# Altium schematic sheet UD3.1 Digital IO.SchDoc
size A4; DocumentNumber: 5; SheetNumber: 5; SheetTotal: 7
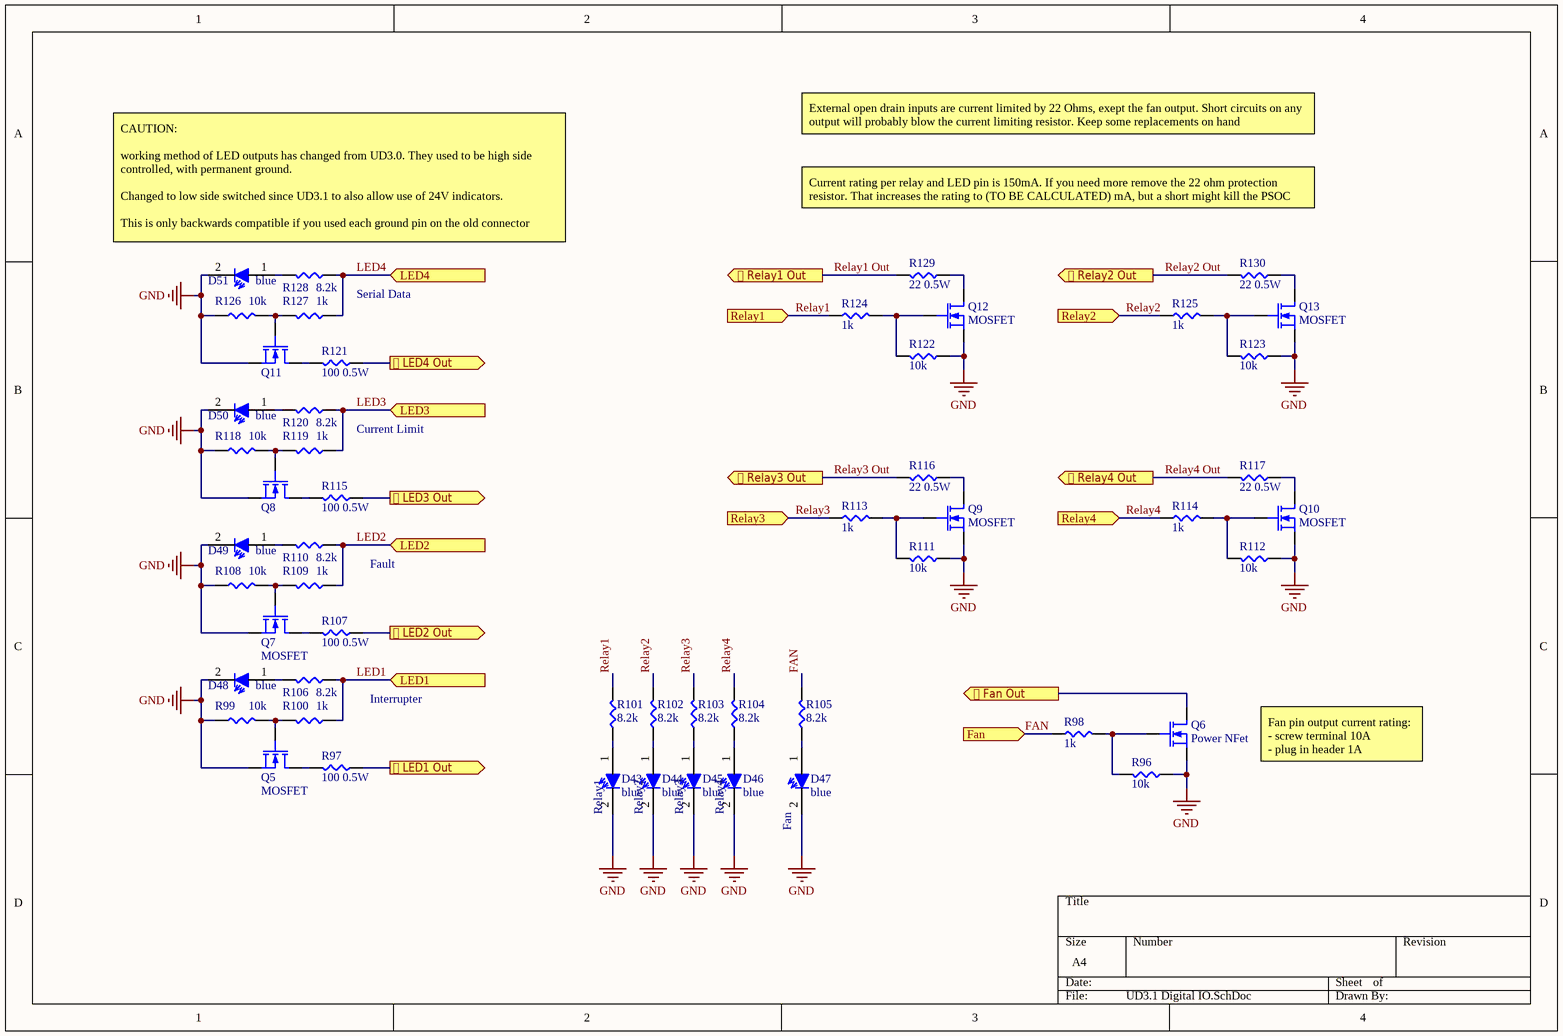
[diagram p0: UD3.1 Digital IO.SchDoc]

## Parts
D43  blue  [1206 Reverse Mount]
D44  blue  [1206 Reverse Mount]
D45  blue  [1206 Reverse Mount]
D46  blue  [1206 Reverse Mount]
D47  blue  [1206 Reverse Mount]
D48  blue  [1206 Reverse Mount]
D49  blue  [1206 Reverse Mount]
D50  blue  [1206 Reverse Mount]
D51  blue  [1206 Reverse Mount]
Q5  MOSFET  [sot 23]
Q6  Power NFet  [SOIC8]
Q7  MOSFET  [sot 23]
Q8  MOSFET  [sot 23]  (value not drawn)
Q9  MOSFET  [sot 23]
Q10  MOSFET  [sot 23]
Q11  MOSFET  [sot 23]  (value not drawn)
Q12  MOSFET  [sot 23]
Q13  MOSFET  [sot 23]
R96  10k  [0603]
R97  100 0.5W  [1206]
R98  1k  [0603]
R99  10k  [0603]
R100  1k  [0603]
R101  8.2k  [0603]
R102  8.2k  [0603]
R103  8.2k  [0603]
R104  8.2k  [0603]
R105  8.2k  [0603]
R106  8.2k  [0603]
R107  100 0.5W  [1206]
R108  10k  [0603]
R109  1k  [0603]
R110  8.2k  [0603]
R111  10k  [0603]
R112  10k  [0603]
R113  1k  [0603]
R114  1k  [0603]
R115  100 0.5W  [1206]
R116  22 0.5W  [1206]
R117  22 0.5W  [1206]
R118  10k  [0603]
R119  1k  [0603]
R120  8.2k  [0603]
R121  100 0.5W  [1206]
R122  10k  [0603]
R123  10k  [0603]
R124  1k  [0603]
R125  1k  [0603]
R126  10k  [0603]
R127  1k  [0603]
R128  8.2k  [0603]
R129  22 0.5W  [1206]
R130  22 0.5W  [1206]

## Ports
Fan (in), LED1 (in), LED2 (in), LED3 (in), LED4 (in), Relay1 (in), Relay2 (in), Relay3 (in), Relay4 (in), ⎐ Fan Out (out), ⎐ LED1 Out (out), ⎐ LED2 Out (out), ⎐ LED3 Out (out), ⎐ LED4 Out (out), ⎐ Relay1 Out (out), ⎐ Relay2 Out (out), ⎐ Relay3 Out (out), ⎐ Relay4 Out (out)

## Nets
GND: D43.2 D44.2 D45.2 D46.2 D47.2 D48.2 D49.2 D50.2 D51.2 Q5.S Q6.S Q7.S Q8.S Q9.S Q10.S Q11.S Q12.S Q13.S R96.1 R99.1 R108.1 R111.1 R112.1 R118.1 R122.1 R123.1 R126.1
FAN: R98.1 R105.1 ; port Fan
LED1: R100.1 R106.1 ; port LED1
LED2: R109.1 R110.1 ; port LED2
LED3: R119.1 R120.1 ; port LED3
LED4: R127.1 R128.1 ; port LED4
Relay1: R101.1 R124.1 ; port Relay1
Relay1 Out: R129.2 ; port ⎐ Relay1 Out
Relay2: R102.1 R125.1 ; port Relay2
Relay2 Out: R130.2 ; port ⎐ Relay2 Out
Relay3: R103.1 R113.1 ; port Relay3
Relay3 Out: R116.2 ; port ⎐ Relay3 Out
Relay4: R104.1 R114.1 ; port Relay4
Relay4 Out: R117.2 ; port ⎐ Relay4 Out
⎐ Fan Out: Q6.D ; port ⎐ Fan Out
⎐ LED1 Out: R97.1 ; port ⎐ LED1 Out
⎐ LED2 Out: R107.1 ; port ⎐ LED2 Out
⎐ LED3 Out: R115.1 ; port ⎐ LED3 Out
⎐ LED4 Out: R121.1 ; port ⎐ LED4 Out
NetD43_1: D43.1 R101.2
NetD44_1: D44.1 R102.2
NetD45_1: D45.1 R103.2
NetD46_1: D46.1 R104.2
NetD47_1: D47.1 R105.2
NetD48_1: D48.1 R106.2
NetD49_1: D49.1 R110.2
NetD50_1: D50.1 R120.2
NetD51_1: D51.1 R128.2
NetQ5_D: Q5.D R97.2
NetQ5_G: Q5.G R99.2 R100.2
NetQ6_G: Q6.G R96.2 R98.2
NetQ7_D: Q7.D R107.2
NetQ7_G: Q7.G R108.2 R109.2
NetQ8_D: Q8.D R115.2
NetQ8_G: Q8.G R118.2 R119.2
NetQ9_D: Q9.D R116.1
NetQ9_G: Q9.G R111.2 R113.2
NetQ10_D: Q10.D R117.1
NetQ10_G: Q10.G R112.2 R114.2
NetQ11_D: Q11.D R121.2
NetQ11_G: Q11.G R126.2 R127.2
NetQ12_D: Q12.D R129.1
NetQ12_G: Q12.G R122.2 R124.2
NetQ13_D: Q13.D R130.1
NetQ13_G: Q13.G R123.2 R125.2

## Notes on the sheet
- External open drain inputs are current limited by 22 Ohms, exept the fan output. Short circuits on any output will probably blow the current limiting resistor. Keep some replacements on hand
- CAUTION:
  working method of LED outputs has changed from UD3.0. They used to be high side controlled, with permanent ground.
  Changed to low side switched since UD3.1 to also allow use of 24V indicators.
  This is only backwards compatible if you used each ground pin on the old connector
- Current rating per relay and LED pin is 150mA. If you need more remove the 22 ohm protection resistor. That increases the rating to (TO BE CALCULATED) mA, but a short might kill the PSOC
- Serial Data
- Current Limit
- Fault
- Interrupter
- Fan pin output current rating:
  - screw terminal 10A
  - plug in header 1A
- (near D43) Relay1
- Relay2
- Relay3
- Relay4
- Fan

## Library data of the parts
D43-D51 = LED: Diode, but it lights up; Supplier 1: Digi-Key; Supplier 2: Digi-Key; Supplier 3: Digi-Key; Supplier 4: Digi-Key; Supplier Part Number 1: 732-4979-1-ND; Supplier Part Number 2: 732-4971-1-ND; Supplier Part Number 3: 732-4966-1-ND; Supplier Part Number 4: 732-4981-1-ND
Q5 Q7-Q13 = Mosfet N: pin to pad: D>3 G>1 S>2; Supplier 1: Digi-Key; Supplier Part Number 1: 1727-5305-1-ND; Supplier 2: Digi-Key; Supplier Part Number 2: 1727-1123-1-ND; Supplier 3: Digi-Key; Supplier 4: Digi-Key; Supplier Part Number 4: T2N7002AKLMCT-ND; Supplier Part Number 3: BSC0906NSATMA1CT-ND; Supplier 5: Digi-Key; Supplier Part Number 5: 1727-4714-1-ND; Supplier 6: Digi-Key; Supplier 7: Digi-Key; Supplier Part Number 6: 497-14572-5-ND; Supplier Part Number 7: IPP180N10N3GXKSA1-ND
Q6 = Mosfet N: pin to pad: D>8+7+6+5 G>4 S>3+2+1; Supplier 1: Digi-Key; Supplier Part Number 1: 1727-5305-1-ND; Supplier 2: Digi-Key; Supplier Part Number 2: 1727-1123-1-ND; Supplier 3: Digi-Key; Supplier 4: Digi-Key; Supplier Part Number 4: T2N7002AKLMCT-ND; Supplier Part Number 3: BSC0906NSATMA1CT-ND; Supplier 5: Digi-Key; Supplier Part Number 5: 1727-4714-1-ND; Supplier 6: Digi-Key; Supplier 7: Digi-Key; Supplier Part Number 6: 497-14572-5-ND; Supplier Part Number 7: IPP180N10N3GXKSA1-ND
R96-R130 = Resistor